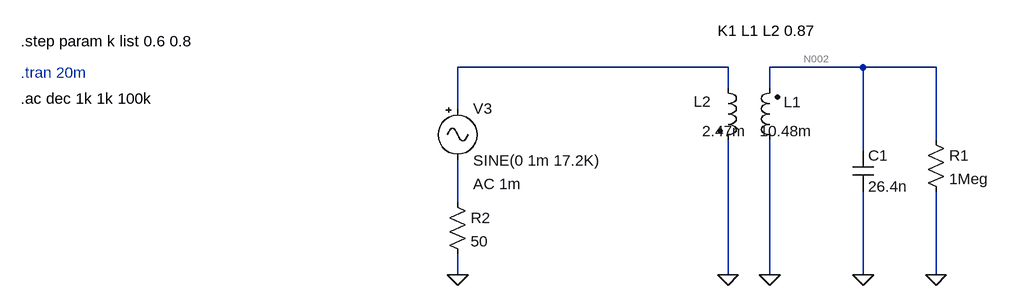
[diagram p0: schematic SAQ_transformer.asc]
SAQ_transformer.asc, the LTspice schematic file:
Version 4
SHEET 1 14772 7332
WIRE 11584 5120 11168 5120
WIRE 11792 5120 11648 5120
WIRE 11904 5120 11792 5120
WIRE 11584 5152 11584 5120
WIRE 11648 5152 11648 5120
WIRE 11168 5184 11168 5120
WIRE 11904 5232 11904 5120
WIRE 11792 5248 11792 5120
WIRE 11168 5328 11168 5264
WIRE 11168 5440 11168 5408
WIRE 11584 5440 11584 5232
WIRE 11648 5440 11648 5232
WIRE 11792 5440 11792 5312
WIRE 11904 5440 11904 5312
FLAG 11648 5440 0
FLAG 11168 5440 0
FLAG 11584 5440 0
FLAG 11904 5440 0
FLAG 11792 5440 0
SYMBOL ind2 11664 5248 R180
WINDOW 0 -33 74 Left 2
WINDOW 3 -50 30 Left 2
SYMATTR InstName L1
SYMATTR Value 10.48m
SYMATTR Type ind
SYMBOL Misc\\signal 11168 5168 R0
WINDOW 123 24 132 Left 2
WINDOW 39 0 0 Left 0
SYMATTR Value2 AC 1m
SYMATTR InstName V3
SYMATTR Value SINE(0 1m 17.2K)
SYMBOL ind2 11568 5136 R0
WINDOW 0 -37 37 Left 2
WINDOW 3 -24 82 Left 2
SYMATTR InstName L2
SYMATTR Value 2.47m
SYMATTR Type ind
SYMBOL res 11888 5216 R0
SYMATTR InstName R1
SYMATTR Value 1Meg
SYMBOL res 11152 5312 R0
SYMATTR InstName R2
SYMATTR Value 50
SYMBOL cap 11776 5248 R0
SYMATTR InstName C1
SYMATTR Value 26.4n
TEXT 10496 5128 Left 2 ;.tran 20m
TEXT 11568 5064 Left 2 !K1 L1 L2 0.87
TEXT 10496 5168 Left 2 !.ac dec 1k 1k 100k
TEXT 10496 5080 Left 2 !.step param k list 0.6 0.8

The netlist it stands for:
* SAQ_transformer.asc
L1 0 N002 10.48m
V3 N001 N003 SINE(0 1m 17.2K) AC 1m
L2 N001 0 2.47m
R1 N002 0 1Meg
R2 N003 0 50
C1 N002 0 26.4n
* .tran 20m
K1 L1 L2 0.87
.ac dec 1k 1k 100k
.step param k list 0.6 0.8
.backanno
.end

* Results of the author's LTspice run, read from the files saved beside the schematic
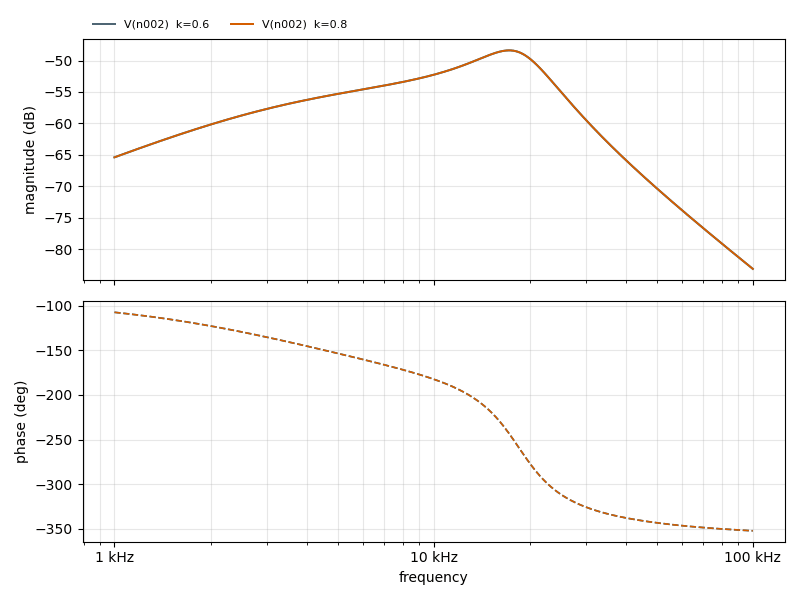
[diagram p1: AC Analysis of SAQ_transformer.asc, plotted from the saved traces]
* AC Analysis, 2 runs:
*   V(n002) [k=0.6]: -65.41 dB at 1 kHz, -83.16 dB at 100 kHz, peak -48.38 dB at 17.22 kHz, 3 dB below the peak at 11.42 kHz and 21.71 kHz
*   V(n002) [k=0.8]: -65.41 dB at 1 kHz, -83.16 dB at 100 kHz, peak -48.38 dB at 17.22 kHz, 3 dB below the peak at 11.42 kHz and 21.71 kHz